# Altium project BloodPressure.PrjPcb
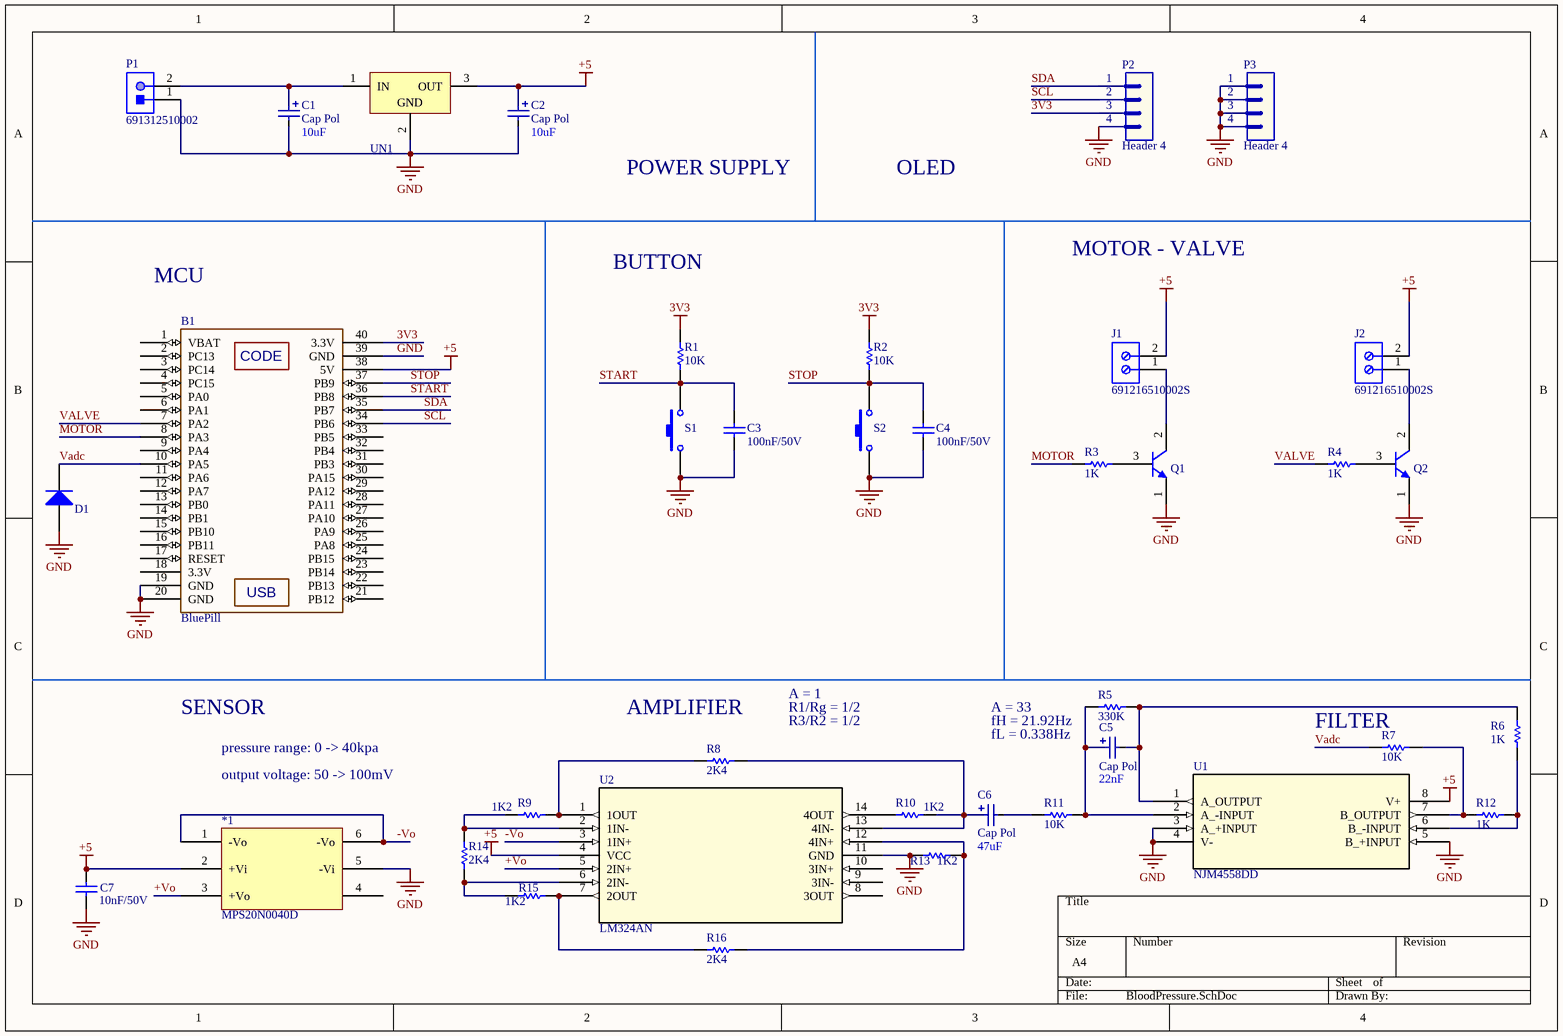
[diagram p0: BloodPressure.SchDoc]
1 sheet, 38 parts. Net scope: global (net labels, ports and power ports of the same name join across sheets).
Board file: BloodPressure.PcbDoc

## Sheet BloodPressure.SchDoc
size A4; SheetNumber: 1; SheetTotal: 1

### Parts
*1  MPS20N0040D  [MPS20N0040D]
B1  BluePill  [BlUEPILL]
C1  Cap Pol  value 10uF  [CP1/2]
C2  Cap Pol  value 10uF  [CP1/2]
C3  value 100nF/50V  [CAP-SM-0805]  (hidden comment: Cap-100nF-50V-0805)
C4  value 100nF/50V  [CAP-SM-0805]  (hidden comment: Cap-100nF-50V-0805)
C5  Cap Pol  value 22nF  [CP1/2]
C6  Cap Pol  value 47uF  [CP1/2]
C7  value 10nF/50V  [CAP-SM-0805]  (hidden comment: Cap-100nF-50V-0805)
D1  Diode  [D1A]  (value not drawn)
J1  691216510002S  [691216510002S]
J2  691216510002S  [691216510002S]
P1  691312510002  [691312510002]
P2  Header 4  [JP4]
P3  Header 4  [JP4]
Q1  C1815  [QTO-92]  (value not drawn)
Q2  C1815  [QTO-92]  (value not drawn)
R1  value 10K  [RES-SM-0805]  (hidden comment: Res-10k-0805)
R2  value 10K  [RES-SM-0805]  (hidden comment: Res-10k-0805)
R3  value 1K  [RES-SM-0805]  (hidden comment: Res-1K-0805)
R4  value 1K  [RES-SM-0805]  (hidden comment: Res-1K-0805)
R5  value 330K  [RES-SM-0805]  (hidden comment: Res-1K-0805)
R6  value 1K  [RES-SM-0805]  (hidden comment: Res-1K-0805)
R7  value 10K  [RES-SM-0805]  (hidden comment: Res-1K-0805)
R8  value 2K4  [RES-SM-0805]  (hidden comment: Res-1K-0805)
R9  value 1K2  [RES-SM-0805]  (hidden comment: Res-1K-0805)
R10  value 1K2  [RES-SM-0805]  (hidden comment: Res-1K-0805)
R11  value 10K  [RES-SM-0805]  (hidden comment: Res-1K-0805)
R12  value 1K  [RES-SM-0805]  (hidden comment: Res-1K-0805)
R13  value 1K2  [RES-SM-0805]  (hidden comment: Res-1K-0805)
R14  value 2K4  [RES-SM-0805]  (hidden comment: Res-1K-0805)
R15  value 1K2  [RES-SM-0805]  (hidden comment: Res-1K-0805)
R16  value 2K4  [RES-SM-0805]  (hidden comment: Res-1K-0805)
S1  Tact SW - 2Pin  [SW2]  (value not drawn)
S2  Tact SW - 2Pin  [SW2]  (value not drawn)
U1  NJM4558DD  [DIP8_NMD]
U2  LM324AN  [N14]
UN1  LM7805  [QTO-220]  (value not drawn)

### Nets
3V3: B1.40(3.3V) P2.3 R1.2 R2.2
+5: *1.2(+Vi) B1.38(5V) C2.1 C7.1 J1.2 J2.2 U1.8(V+) U2.4(VCC) UN1.3(OUT)
GND: *1.5(-Vi) B1.19(GND) B1.20(GND) B1.39(GND) C1.2 C2.2 C3.1 C4.1 C7.2 D1.1(A) P1.1 P2.4 P3.1 P3.2 P3.3 P3.4 Q1.1(E) Q2.1(E) R13.1 S1.1 S2.1 U1.3(A_+INPUT) U1.4(V-) U1.5(B_+INPUT) U2.11(GND) UN1.2(GND)
+Vo: *1.3(+Vo) U2.5(2IN+)
-Vo: *1.1(-Vo) *1.6(-Vo) U2.3(1IN+)
MOTOR: B1.8(PA3) R3.1
SCL: B1.34(PB6) P2.2
SDA: B1.35(PB7) P2.1
START: B1.36(PB8) C3.2 R1.1 S1.2
STOP: B1.37(PB9) C4.2 R2.1 S2.2
Vadc: B1.10(PA5) D1.2(K) R7.1
VALVE: B1.7(PA2) R4.1
NetC1_1: C1.1 P1.2 UN1.1(IN)
NetC5_1: C5.1 R5.1 R11.2 U1.2(A_-INPUT)
NetC5_2: C5.2 R5.2 R6.2 U1.1(A_OUTPUT)
NetC6_1: C6.1 R8.2 R10.2 U2.13(4IN-)
NetC6_2: C6.2 R11.1
NetJ1_1: J1.1 Q1.2(C)
NetJ2_1: J2.1 Q2.2(C)
NetQ1_3: Q1.3(B) R3.2
NetQ2_3: Q2.3(B) R4.2
NetR6_1: R6.1 R12.2 U1.6(B_-INPUT)
NetR7_2: R7.2 R12.1 U1.7(B_OUTPUT)
NetR8_1: R8.1 R9.2 U2.1(1OUT)
NetR9_1: R9.1 R14.2 U2.2(1IN-)
NetR10_1: R10.1 U2.14(4OUT)
NetR13_2: R13.2 R16.2 U2.12(4IN+)
NetR14_1: R14.1 R15.1 U2.6(2IN-)
NetR15_2: R15.2 R16.1 U2.7(2OUT)

Not connected (* = marked no-connect by the designer): *1 4; B1 1(VBAT) 2(PC13) 3(PC14) 4(PC15) 5(PA0) 6(PA1) 9(PA4) 11(PA6) 12(PA7) 13(PB0) 14(PB1) 15(PB10) 16(PB11) 17(RESET) 18(3.3V) 21(PB12) 22(PB13) 23(PB14) 24(PB15) 25(PA8) 26(PA9) 27(PA10) 28(PA11) 29(PA12) 30(PA15) 31(PB3) 32(PB4) 33(PB5); U2 8(3OUT) 9(3IN-) 10(3IN+)

### Notes on the sheet
- POWER SUPPLY
- OLED
- MOTOR - VALVE
- MCU
- BUTTON
- SENSOR
- (near R8) AMPLIFIER
- A = 1
- R1/Rg = 1/2
- R3/R2 = 1/2
- A = 33
- fH = 21.92Hz
- (near R7) FILTER
- pressure range: 0 -> 40kpa
- output voltage: 50 -> 100mV
- fL = 0.338Hz
- (in symbol BluePill) CODE; USB

### Library data of the parts
C1 C2 C5 C6 = Cap-TH-Pol: Polarized Capacitor (Radial)
C3 C4 C7 = Cap-100nF-50V-0805: CAP CER 0.1UF 50V Y5V 0805; Manufacturer: Samsung Electro-Mechanics; Manufacturer Part Number: CL21F104ZBCNNNC; Local Supplier: thegioiic; Local Supplier Link: https://www.thegioiic.com/products/tu-gom-0805-100nf-0-1uf-50v; Supplier 1: Digikey; Supplier 1 Part Number: 1276-1007-1-ND; Supplier 1 Link: https://www.digikey.com/product-detail/en/samsung-electro-mechanics/CL21F104ZBCNNNC/1276-1007-1-ND/3889093
D1 = Diode: Default Diode
J1 J2 = 691216510002S: WR-TBL Serie 2165S Horizontal Entry Modular, Rising Cage Clamp, pitch 5.08mm, 2p; Compliance: ROHS & Reach; Modularity: Yes; PCB/Cable/Panel: PCB; Pin Number: 2; Rated Current [UL]: 14A; Working Voltage [UL]: 300VAC; ComponentLink1Description: Manufacturer; ComponentLink1URL: http://www.we-online.de; ComponentLink2URL: https://katalog.we-online.de/em/datasheet/691216510002S.pdf; ComponentLink2Description: Datasheet; Mounting Technology: THT; Part Number: 691216510002S; Packaging: Box; Operating Temperature: -30 to +120degC; Pitch: 5.08mm; Published Date: October 2019; Type: Horizontal; Publisher: Wurth Elektronik; Application: Rising Cage Clamp
P1 = 691312510002: WR-TBL Serie 312 Open Horizontal PCB Header, Pluggable, pitch 5.08mm, 2p; Compliance: RoHS; Modularity: No; Pin Number: 2; Rated Current [UL]: 20A; Working Voltage [UL]: 300VAC; ComponentLink1Description: Manufacturer; ComponentLink1URL: http://www.we-online.de; ComponentLink2URL: https://katalog.we-online.de/em/datasheet/691312510002.pdf; ComponentLink2Description: Datasheet; Mounting Technology: THT; Part Number: 691312510002; Packaging: Box; Operating Temperature: -40 to +105degC; PCB/Cable/Panel: PCB; Pitch: 5.08mm; Published Date: October 2019; Type: Horizontal; Publisher: Wurth Elektronik; Application: Pluggable
P2 P3 = Header 4: Header, 4-Pin; LatestRevisionDate: 17-Jul-2002; LatestRevisionNote: Re-released for DXP Platform.; Publisher: Altium Limited; Local Supplier: thegioiic; Local Supplier Part Number: x; Local Supplier Link: https://www.thegioiic.com/products/hang-rao-duc-don-2-54mm-40-chan-1-hang-cao-11-4mm-xuyen-lo
Q1 Q2 = C1815: NPN Bipolar Transistor
R1 R2 = Res-10k-0805: RES 10K OHM 1% 1/4W 0805; Manufacturer: Stackpole Electronics Inc; Manufacturer Part Number: RNCP0805FTD10K0; Local Supplier: thegioiic; Local Supplier Link: https://www.thegioiic.com/products/dien-tro-10-kohm-0805-5; Supplier 1: Digikey; Supplier 1 Link: https://www.digikey.com/product-detail/en/stackpole-electronics-inc/RNCP0805FTD10K0/RNCP0805FTD10K0CT-ND/2240601; Supplier 1 Part Number: RNCP0805FTD10K0CT-ND
R3-R16 = Res-1K-0805: RES 1K OHM 1% 1/4W 0805; Manufacturer: Stackpole Electronics Inc; Manufacturer Part Number: RNCP0805FTD1K00; Local Supplier: thegioiic; Local Supplier Link: https://www.thegioiic.com/products/dien-tro-1-kohm-0805-5; Supplier 1: Digikey; Supplier 1 Link: https://www.digikey.com/product-detail/en/stackpole-electronics-inc/RNCP0805FTD1K00/RNCP0805FTD1K00CT-ND/2240568; Supplier 1 Part Number: RNCP0805FTD1K00CT-ND
S1 S2 = Tact SW - 2Pin: Switch button 2 pin
U1 = NJM4558DD: No Description Available; Mfr_Name: Nisshinbo Micro Devices; RefDes: RefDes; Type: Type
U2 = LM324AN: No Description Available; Mfr_Name: Texas Instruments; RefDes: RefDes; Type: Type
UN1 = LM7805: Positive Voltage Regulator